# EasyEDA schematic generator-controller-schematic.json
TITLE: Inverter Controller; REV: 1.0; Date: 2023-10-26; Sheet: 1/1; Drawn By: lucyhapsti; Company: N/A
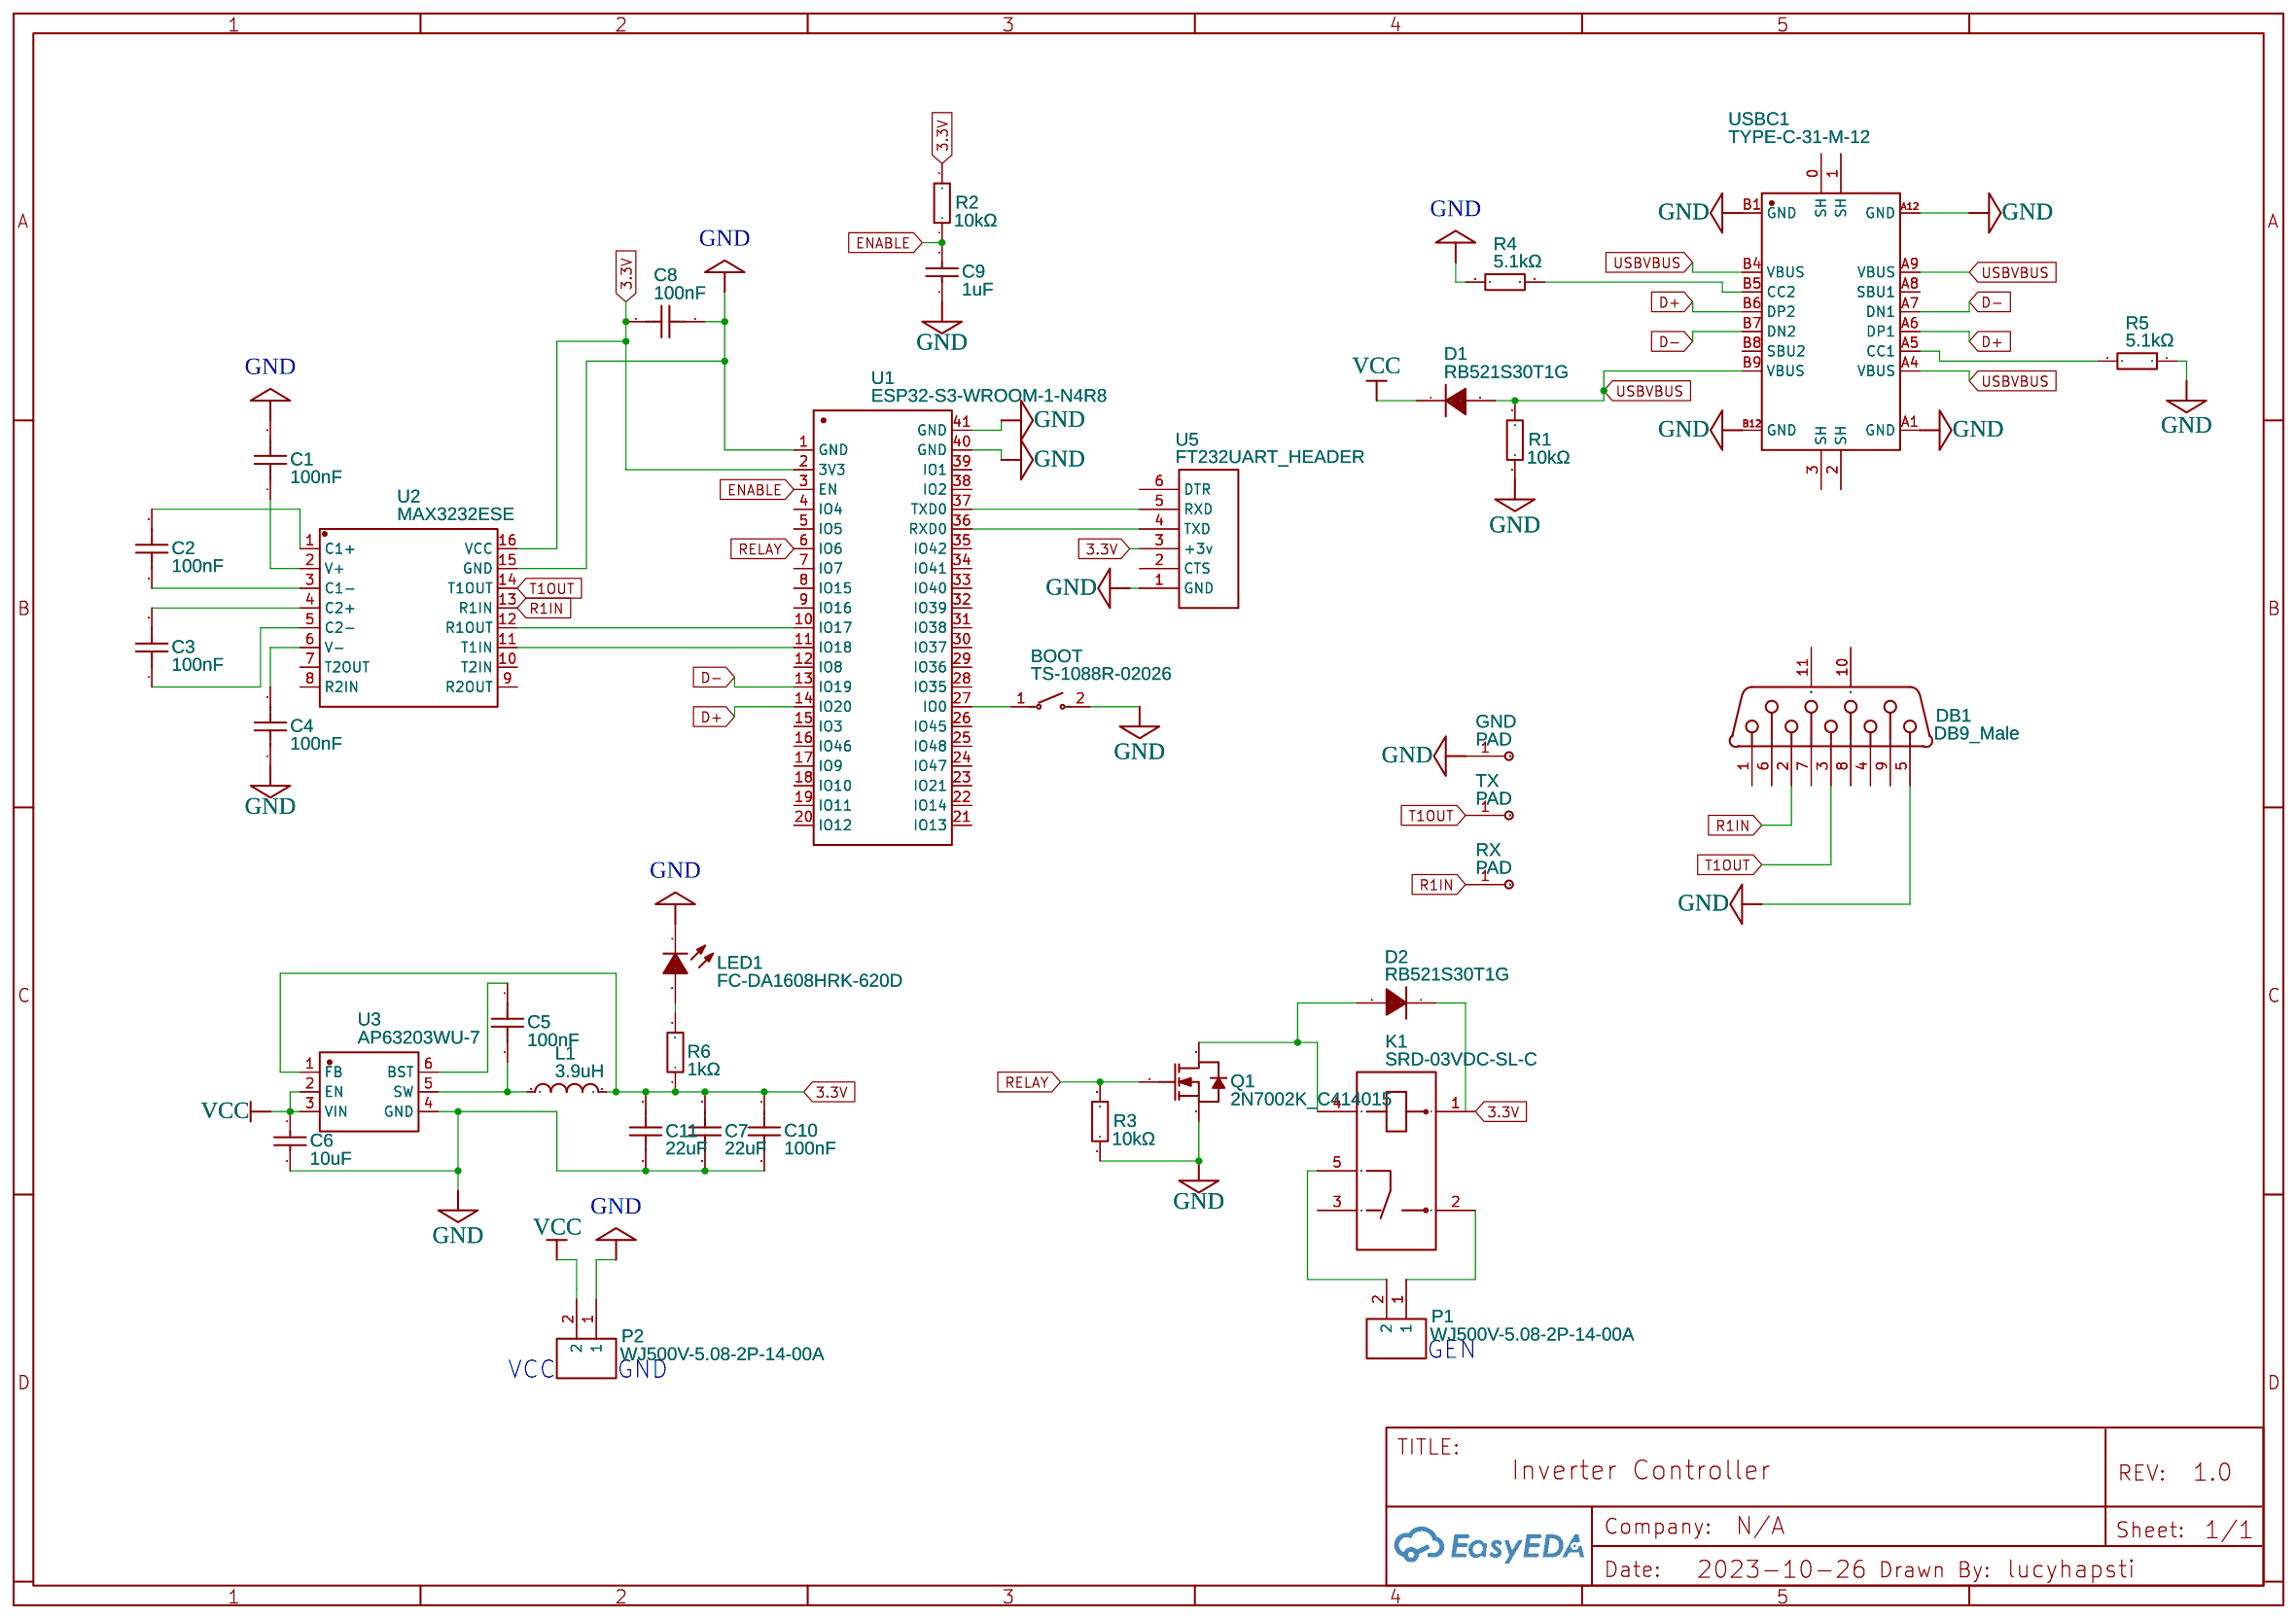
[diagram p0: schematic sheet]

## Parts
BOOT  TS-1088R-02026  [SW-SMD_L3.9-W3.0-P4.45]
C1  100nF  [C0402]
C2  100nF  [C0402]
C3  100nF  [C0402]
C4  100nF  [C0402]
C5  100nF  [C0402]
C6  10uF  [C1206]
C7  22uF  [C0402]
C8  100nF  [C0402]
C9  1uF  [C0402]
C10  100nF  [C0402]
C11  22uF  [C0402]
D1  RB521S30T1G  [SOD-523_L1.2-W0.8-LS1.6-RD]
D2  RB521S30T1G  [SOD-523_L1.2-W0.8-LS1.6-RD]
DB1  DB9_Male  [DSUB-TH_DMR-9P]
GND  PAD  [PADPAD]
K1  SRD-03VDC-SL-C  [RELAY-TH_SRD-XXVDC-XL-C]
L1  3.9uH  [IND-SMD_L4.0-W4.0]
LED1  FC-DA1608HRK-620D  [LED0603-RD_RED]
P1  WJ500V-5.08-2P-14-00A  [CONN-TH_2P-P5.00_WJ500V-5.08-2P]
P2  WJ500V-5.08-2P-14-00A  [CONN-TH_2P-P5.00_WJ500V-5.08-2P]
Q1  2N7002K_C414015  [SOT-23-3_L2.9-W1.3-P1.90-LS2.4-BR]
R1  10kΩ  [R0402]
R2  10kΩ  [R0402]
R3  10kΩ  [R0402]
R4  5.1kΩ  [R0402]
R5  5.1kΩ  [R0402]
R6  1kΩ  [R0402]
RX  PAD  [PADPAD]
TX  PAD  [PADPAD]
U1  ESP32-S3-WROOM-1-N4R8  [WIRELM-SMD_ESP32-S3-WROOM-1]
U2  MAX3232ESE  [SOP-16_L9.9-W3.9-P1.27-LS6.0-BL]
U3  AP63203WU-7  [TSOT-26_L2.9-W1.6-P0.95-LS2.8-BL]
U5  FT232UART_HEADER  [FT232UART_HEADER]
USBC1  TYPE-C-31-M-12  [USB-C_SMD-TYPE-C-31-M-12]

## Library data of the parts
BOOT = TS-1088R-02026: Contributor: LCSC; Supplier: LCSC; Supplier Part: C455280; Manufacturer: XUNPU(讯普); JLCPCB Part Class: Extended Part; link: https://lcsc.com/eda_search?q=C455280&%26type=1&ref=editor
C1-C5 C8 C10 = CC0402KRX7R5BB104: Contributor: LCSC; Supplier: LCSC; Supplier Part: C541406; Manufacturer: YAGEO(国巨); JLCPCB Part Class: Extended Part; link: https://lcsc.com/eda_search?q=C541406&%26type=1&ref=editor
C6 = CL31A106KBHNNNE: Supplier: LCSC; Manufacturer: SAMSUNG(三星); Supplier Part: C13585; JLCPCB Part Class: Basic Part; link: https://lcsc.com/eda_search?q=C13585&%26type=1&ref=editor
C7 C11 = GRM155R60J226ME11D: Contributor: LCSC; Supplier: LCSC; Supplier Part: C415703; Manufacturer: muRata(村田); JLCPCB Part Class: Extended Part; link: https://lcsc.com/eda_search?q=C415703&%26type=1&ref=editor
C9 = CL05A105KQ5NNNC: Supplier: LCSC; Manufacturer: SAMSUNG(三星); Supplier Part: C107372; JLCPCB Part Class: Extended Part; link: https://lcsc.com/eda_search?q=C107372&%26type=1&ref=editor
D1 D2 = RB521S30T1G: Contributor: LCSC; Supplier: LCSC; Supplier Part: C145179; Manufacturer: onsemi(安森美); JLCPCB Part Class: Extended Part; link: https://lcsc.com/eda_search?q=C145179&%26type=1&ref=editor
DB1 = DB9_Male: Supplier Part: C141880; Supplier: LCSC; Manufacturer: Ckmtw; Contributor: LCEDA_Lib
GND RX TX = PAD: Contributor: vaskul
K1 = SRD-03VDC-SL-C: Supplier: LCSC; Manufacturer: 松乐; Supplier Part: C24585; JLCPCB Part Class: Extended Part; link: https://lcsc.com/eda_search?q=C24585&%26type=1&ref=editor
L1 = SWPA4030S3R9MT: Contributor: lcsc; Supplier: LCSC; Supplier Part: C96899; Manufacturer: Sunlord(顺络); JLCPCB Part Class: Extended Part; link: https://lcsc.com/eda_search?q=C96899&%26type=1&ref=editor
LED1 = FC-DA1608HRK-620D: Supplier: LCSC; Manufacturer: 国星光电; Manufacturer Part: NCD0603R1; Supplier Part: C84263; JLCPCB Part Class: Extended Part; link: https://lcsc.com/eda_search?q=C84263&%26type=1&ref=editor
P1 P2 = WJ500V-5.08-2P-14-00A: Supplier: LCSC; Manufacturer: KANGNEX(康奈克斯电气); Manufacturer Part: WJ500V-5.08-2P; Supplier Part: C8465; JLCPCB Part Class: Extended Part; link: https://lcsc.com/eda_search?q=C8465&%26type=1&ref=editor
Q1 = 2N7002K_C414015: Contributor: LCSC; Supplier: LCSC; Supplier Part: C414015; Manufacturer: MDD; Manufacturer Part: 2N7002K; JLCPCB Part Class: Extended Part; link: https://lcsc.com/eda_search?q=C414015&%26type=1&ref=editor
R1-R3 = RC0402FR-0710KL: Supplier: LCSC; Manufacturer: YAGEO(国巨); Supplier Part: C60490; JLCPCB Part Class: Extended Part; link: https://lcsc.com/eda_search?q=C60490&%26type=1&ref=editor
R4 R5 = 0402WGF5101TCE: Supplier: LCSC; Manufacturer: UNI-ROYAL(厚声); Supplier Part: C25905; JLCPCB Part Class: Basic Part; link: https://lcsc.com/eda_search?q=C25905&%26type=1&ref=editor
R6 = 0402WGF1001TCE: Supplier: LCSC; Manufacturer: UNI-ROYAL(厚声); Supplier Part: C11702; JLCPCB Part Class: Basic Part; link: https://lcsc.com/eda_search?q=C11702&%26type=1&ref=editor
U1 = ESP32-S3-WROOM-1-N4R8: Contributor: lcsc; Supplier: LCSC; Supplier Part: C2913200; Manufacturer: ESPRESSIF(乐鑫); JLCPCB Part Class: Extended Part; link: https://lcsc.com/eda_search?q=C2913200&%26type=1&ref=editor
U2 = MAX3232ESE: Contributor: LCSC; Supplier: LCSC; Supplier Part: C2904738; Manufacturer: UMW(广东友台半导体); JLCPCB Part Class: Extended Part; link: https://lcsc.com/eda_search?q=C2904738&%26type=1&ref=editor
U3 = AP63203WU-7: Contributor: LCSC; Supplier: LCSC; Supplier Part: C780769; Manufacturer: DIODES(美台); JLCPCB Part Class: Extended Part; link: https://lcsc.com/eda_search?q=C780769&%26type=1&ref=editor
U5 = FT232UART_HEADER: Contributor: phanegraaf
USBC1 = TYPE-C-31-M-12: Contributor: LCSC; Supplier: LCSC; Supplier Part: C165948; Manufacturer: 韩国韩荣; JLCPCB Part Class: Extended Part; link: https://lcsc.com/eda_search?q=C165948&%26type=1&ref=editor

## Nets
3.3V: C7.2 C8.1 C10.1 C11.2 K1.1 L1.2 R2.2 R6.1 U1.2(3V3) U2.16(VCC) U3.1(FB) U5.3(+3v)
GND: BOOT.2 C1.2 C4.1 C6.1 C7.1 C8.2 C9.1 C10.2 C11.1 DB1.5 GND.1(Pad) LED1.1(K) P2.1 Q1.2(S) R1.1 R3.1 R4.1 R5.1 U1.1(GND) U1.40(GND) U1.41(GND) U2.15(GND) U3.4(GND) U5.1(GND) USBC1.A1(GND) USBC1.A12(GND) USBC1.B1(GND) USBC1.B12(GND)
VCC: C6.2 D1.1(C) P2.2 U3.2(EN) U3.3(VIN)
D+: U1.14(IO20) USBC1.A6(DP1) USBC1.B6(DP2)
D-: U1.13(IO19) USBC1.A7(DN1) USBC1.B7(DN2)
ENABLE: C9.2 R2.1 U1.3(EN)
R1IN: DB1.2 RX.1(Pad) U2.13(R1IN)
RELAY: Q1.1(G) R3.2 U1.6(IO6)
T1OUT: DB1.3 TX.1(Pad) U2.14(T1OUT)
USBVBUS: D1.2(A) R1.2 USBC1.A4(VBUS) USBC1.A9(VBUS) USBC1.B4(VBUS) USBC1.B9(VBUS)
Net-(BOOT-1): BOOT.1 U1.27(IO0)
Net-(C1-1): C1.1 U2.2(V+)
Net-(C2-1): C2.1 U2.3(C1-)
Net-(C2-2): C2.2 U2.1(C1+)
Net-(C3-1): C3.1 U2.5(C2-)
Net-(C3-2): C3.2 U2.4(C2+)
Net-(C4-2): C4.2 U2.6(V-)
Net-(C5-1): C5.1 U3.6(BST)
Net-(C5-2): C5.2 L1.1 U3.5(SW)
Net-(D2-2): D2.2(A) K1.4 Q1.3(D)
Net-(K1-2): K1.2 P1.1
Net-(K1-5): K1.5 P1.2
Net-(LED1-2): LED1.2(A) R6.2
Net-(R4-2): R4.2 USBC1.B5(CC2)
Net-(R5-2): R5.2 USBC1.A5(CC1)
Net-(U1-10): U1.10(IO17) U2.12(R1OUT)
Net-(U1-11): U1.11(IO18) U2.11(T1IN)
Net-(U1-36): U1.36(RXD0) U5.4(TXD)
Net-(U1-37): U1.37(TXD0) U5.5(RXD)

Not connected (* = marked no-connect by the designer): D2 1(C); DB1 1 4 6 7 8 9 10(MH1) 11(MH2); K1 3; U1 4(IO4) 5(IO5) 7(IO7) 8(IO15) 9(IO16) 12(IO8) 15(IO3) 16(IO46) 17(IO9) 18(IO10) 19(IO11) 20(IO12) 21(IO13) 22(IO14) 23(IO21) 24(IO47) 25(IO48) 26(IO45) 28(IO35) 29(IO36) 30(IO37) 31(IO38) 32(IO39) 33(IO40) 34(IO41) 35(IO42) 38(IO2) 39(IO1); U2 7(T2OUT) 8(R2IN) 9(R2OUT) 10(T2IN); U5 2(CTS) 6(DTR); USBC1 0(SH) 1(SH) 2(SH) 3(SH) A8(SBU1) B8(SBU2)

## Notes on the sheet
- GEN
- VCC
- GND
